# EAGLE design BATT_CPU_TEST (EAGLE 9.5.2)
COMPANY: ADAFRUIT INDUSTRIES; DRAWN: KTOWN; REV: B
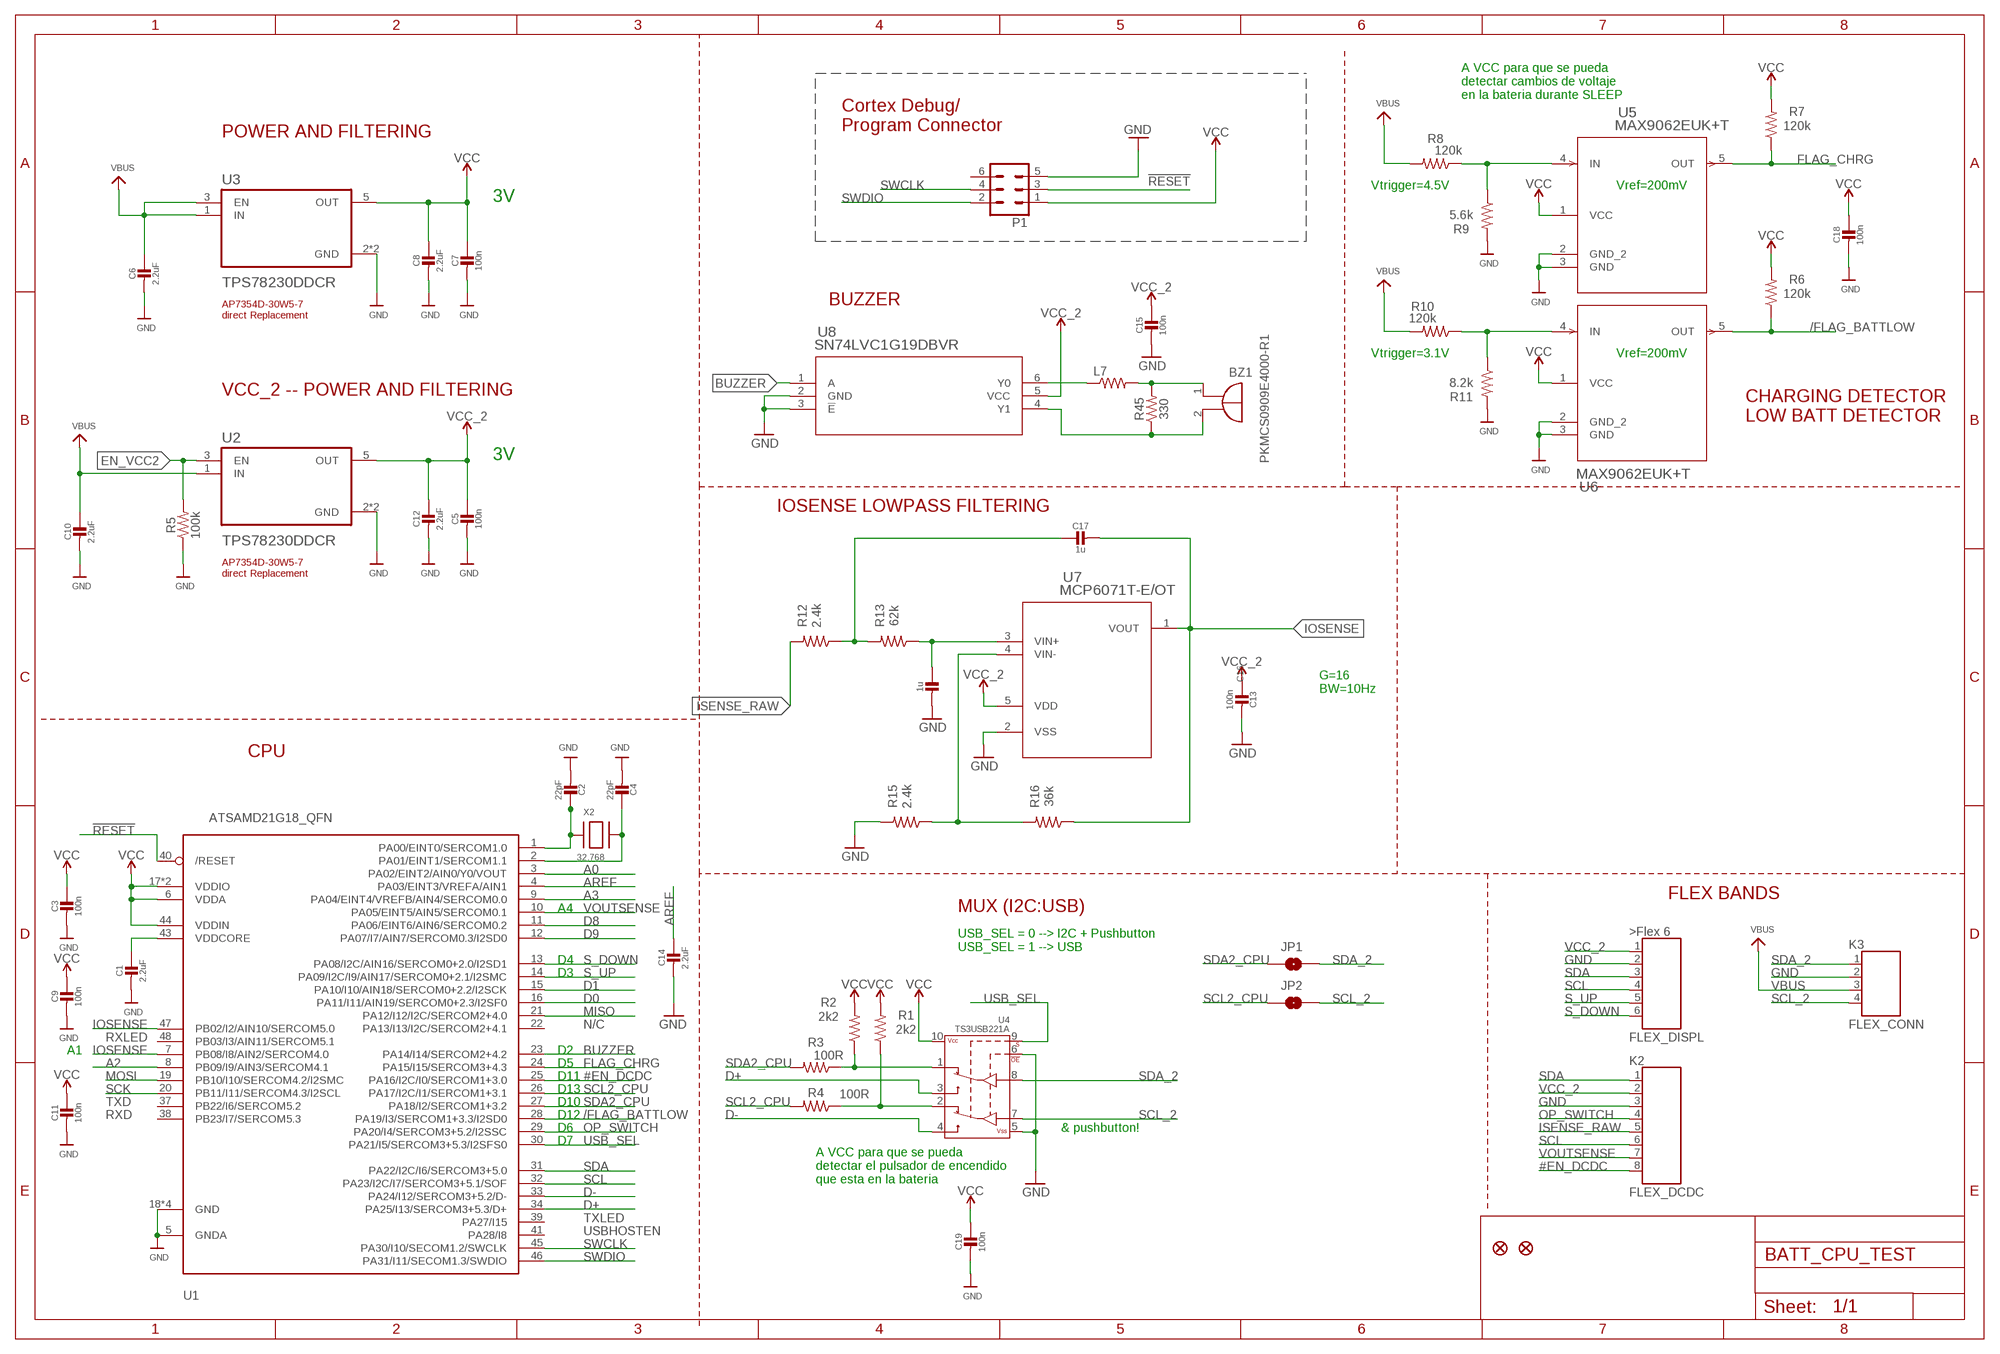
[diagram p0: schematic, sheet 1]

## Parts
BZ1  PKMCS0909E4000-R1  [PKMCS0909]
C1  2.2uF  CAP_CERAMIC0603_NO  [0603-NO]
C2  22pF  CAP_CERAMIC0603_NO  [0603-NO]
C3  100n  CAP_CERAMIC0603_NO  [0603-NO]
C4  22pF  CAP_CERAMIC0603_NO  [0603-NO]
C5  100n  CAP_CERAMIC0603_NO  [0603-NO]
C6  2.2uF  CAP_CERAMIC0805-NOOUTLINE  [0805-NO]
C7  100n  CAP_CERAMIC0603_NO  [0603-NO]
C8  2.2uF  CAP_CERAMIC0805-NOOUTLINE  [0805-NO]
C9  100n  CAP_CERAMIC0603_NO  [0603-NO]
C10  2.2uF  CAP_CERAMIC0805-NOOUTLINE  [0805-NO]
C11  100n  CAP_CERAMIC0603_NO  [0603-NO]
C12  2.2uF  CAP_CERAMIC0805-NOOUTLINE  [0805-NO]
C13  100n  CAP_CERAMIC0603_NO  [0603-NO]
C14  2.2uF  CAP_CERAMIC0603_NO  [0603-NO]
C15  100n  CAP_CERAMIC0603_NO  [0603-NO]
C16  1u  CAP_CERAMIC0603_NO  [0603-NO]
C17  1u  CAP_CERAMIC0603_NO  [0603-NO]
C18  100n  CAP_CERAMIC0603_NO  [0603-NO]
C19  100n  CAP_CERAMIC0603_NO  [0603-NO]
JP1  JUMPER-SMT_2_NO_SILK  [SMT-JUMPER_2_NO_SILK]
JP2  JUMPER-SMT_2_NO_SILK  [SMT-JUMPER_2_NO_SILK]
K1  FLEX_DISPL  FLEX6  [FLEX6]
K2  FLEX_DCDC  FLEX8  [FLEX8]
K3  FLEX_CONN  FLEX4  [FLEX4]
L7  MMZ2012Y202BT000  RESISTOR0805-RES  [0805]
P1  CONN03X2-PROGRAM-POGO-SWD-1.27  [2X3-PROGRAM-POGO-SWD-1.27]
R1  2k2  RESISTOR0603  [0603]
R2  2k2  RESISTOR0603  [0603]
R3  100R  RESISTOR0603  [0603]
R4  100R  RESISTOR0603  [0603]
R5  100k  RESISTOR0603  [0603]
R6  120k  RESISTOR0603  [0603]
R7  120k  RESISTOR0603  [0603]
R8  120k  RESISTOR0603  [0603]
R9  5.6k  RESISTOR0603  [0603]
R10  120k  RESISTOR0603  [0603]
R11  8.2k  RESISTOR0603  [0603]
R12  2.4k  RESISTOR0603  [0603]
R13  62k  RESISTOR0603  [0603]
R15  2.4k  RESISTOR0603  [0603]
R16  36k  RESISTOR0603  [0603]
R45  330  RESISTOR0603  [0603]
U1  ATSAMD21G18_QFN  ATSAMD21J_QFN  [TQFN48_7MM]
U2  TPS78230DDCR  [SOT95P280X110-5N]
U3  TPS78230DDCR  [SOT95P280X110-5N]
U4  TS3USB221A  [QFN-10-RSE]
U5  MAX9062EUK+T  [21-0057F_MXM]
U6  MAX9062EUK+T  [21-0057F_MXM]
U7  MCP6071T-E/OT  [SOT-23-5_MC_MCH]
U8  SN74LVC1G19DBVR  [DBV6]
U$34  FIDUCIAL""  [FIDUCIAL_1MM]
U$35  FIDUCIAL""  [FIDUCIAL_1MM]
X2  32.768  XTAL-3.2X1.5  [XTAL3215]

## Nets
!RESET: P1.3 U1.40(/RESET)
#EN_DCDC: K2.8 U1.25(PA16/I2C/I0/SERCOM1+3.0)
/FLAG_BATTLOW: R6.1 U1.28(PA19/I3/SERCOM1+3.3/I2SD0) U6.5(OUT)
A0: U1.3(PA02/EINT2/AIN0/Y0/VOUT)
A2: U1.8(PB09/I9/AIN3/SERCOM4.1)
A3: U1.9(PA04/EINT4/VREFB/AIN4/SERCOM0.0)
AREF: C14.1 U1.4(PA03/EINT3/VREFA/AIN1)
BUZZER: U1.23(PA14/I14/SERCOM2+4.2) U8.1(A)
D0: U1.16(PA11/I11/AIN19/SERCOM0+2.3/I2SF0)
D1: U1.15(PA10/I10/AIN18/SERCOM0+2.2/I2SCK)
D8: U1.11(PA06/EINT6/AIN6/SERCOM0.2)
D9: U1.12(PA07/I7/AIN7/SERCOM0.3/I2SD0)
D+: U1.34(PA25/I13/SERCOM3+5.3/D+) U4.3(2D+)
D-: U1.33(PA24/I12/SERCOM3+5.2/D-) U4.4(2D-)
EN_VCC2: R5.2 U2.3(EN)
FLAG_CHRG: R7.1 U1.24(PA15/I15/SERCOM3+4.3) U5.5(OUT)
GND: C1.2 C2.2 C3.2 C4.2 C5.2 C6.2 C7.2 C8.2 C9.2 C10.2 C11.2 C12.2 C13.2 C14.2 C15.2 C16.2 C18.2 C19.2 K1.2 K2.3 K3.2 P1.5 R5.1 R9.2 R11.2 R15.2 U1.5(GNDA) U1.18(GND) U1.35(GND) U1.42(GND) U1.THERMAL(GND) U2.2(GND) U2.4(GND) U3.2(GND) U3.4(GND) U4.5(VSS) U4.6(!OE) U5.2(GND_2) U5.3(GND) U6.2(GND_2) U6.3(GND) U7.2(VSS) U8.2(GND) U8.3(!E)
IOSENSE: C17.2 R16.1 U1.7(PB08/I8/AIN2/SERCOM4.0) U1.47(PB02/I2/AIN10/SERCOM5.0) U7.1(VOUT)
ISENSE_RAW: K2.5 R12.2
MISO: U1.21(PA12/I12/I2C/SERCOM2+4.0)
MOSI: U1.19(PB10/I10/SERCOM4.2/I2SMC)
N$1: R15.1 R16.2 U7.4(VIN-)
N$2: R2.1 R3.1 U4.1(1D+)
N$3: R1.1 R4.1 U4.2(1D-)
N$5: C2.1 U1.1(PA00/EINT0/SERCOM1.0) X2.P$1
N$7: C4.1 U1.2(PA01/EINT1/SERCOM1.1) X2.P$2
N$8: C17.1 R12.1 R13.2
N$10: R10.1 R11.1 U6.4(IN)
N$11: R8.1 R9.1 U5.4(IN)
N$13: C16.1 R13.1 U7.3(VIN+)
N$17: L7.1 U8.6(Y0)
N$19: BZ1.1(+) L7.2 R45.2
N$22: BZ1.2(-) R45.1 U8.4(Y1)
OP_SWITCH: K2.4 U1.29(PA20/I4/SERCOM3+5.2/I2SSC)
S_DOWN: K1.6 U1.13(PA08/I2C/AIN16/SERCOM0+2.0/I2SD1)
S_UP: K1.5 U1.14(PA09/I2C/I9/AIN17/SERCOM0+2.1/I2SMC)
SCK: U1.20(PB11/I11/SERCOM4.3/I2SCL)
SCL: K1.4 K2.6 U1.32(PA23/I2C/I7/SERCOM3+5.1/SOF)
SCL2_CPU: JP2.1 R4.2 U1.26(PA17/I2C/I1/SERCOM1+3.1)
SCL_2: JP2.2 K3.4 U4.7(D-)
SDA: K1.3 K2.1 U1.31(PA22/I2C/I6/SERCOM3+5.0)
SDA2_CPU: JP1.1 R3.2 U1.27(PA18/I2/SERCOM1+3.2)
SDA_2: JP1.2 K3.1 U4.8(D+)
SWCLK: P1.4 U1.45(PA30/I10/SECOM1.2/SWCLK)
SWDIO: P1.2 U1.46(PA31/I11/SECOM1.3/SWDIO)
USB_SEL: U1.30(PA21/I5/SERCOM3+5.3/I2SFS0) U4.9(S)
VBUS: C6.1 C10.1 K3.3 R8.2 R10.2 U2.1(IN) U3.1(IN) U3.3(EN)
VCC: C3.1 C7.1 C8.1 C9.1 C11.1 C18.1 C19.1 P1.1 R1.2 R2.2 R6.2 R7.2 U1.6(VDDA) U1.17(VDDIO) U1.36(VDDIO) U1.44(VDDIN) U3.5(OUT) U4.10(VCC) U5.1(VCC) U6.1(VCC)
VCC_2: C5.1 C12.1 C13.1 C15.1 K1.1 K2.2 U2.5(OUT) U7.5(VDD) U8.5(VCC)
VDDCORE: C1.1 U1.43(VDDCORE)
VOUTSENSE: K2.7 U1.10(PA05/EINT5/AIN5/SERCOM0.1)
Unconnected: P1.6 U1.22(PA13/I13/I2C/SERCOM2+4.1) U1.37(PB22/I6/SERCOM5.2) U1.38(PB23/I7/SERCOM5.3) U1.39(PA27/I15) U1.41(PA28/I8) U1.48(PB03/I3/AIN11/SERCOM5.1)

## Notes on the sheet
- Cortex Debug/
  Program Connector
- A VCC para que se pueda
  detectar cambios de voltaje
  en la bateria durante SLEEP
- POWER AND FILTERING
- Vtrigger=4.5V | Vref=200mV
- 3V
- BUZZER
- AP7354D-30W5-7 
  direct Replacement
- Vtrigger=3.1V | Vref=200mV
- VCC_2 -- POWER AND FILTERING
- CHARGING DETECTOR
  LOW BATT DETECTOR
- 3V
- IOSENSE LOWPASS FILTERING
- AP7354D-30W5-7 
  direct Replacement
- G=16
  BW=10Hz
- CPU
- FLEX BANDS
- A4 | MUX (I2C:USB)
- USB_SEL = 0 --> I2C + Pushbutton
  USB_SEL = 1 --> USB
- D4
- D3
- N/C
- RXLED
- A1 | D2
- D5
- D11
- D13
- TXD | D10
- RXD | D12
- D6 | & pushbutton!
- D7
- A VCC para que se pueda
  detectar el pulsador de encendido
  que esta en la bateria
- TXLED
- USBHOSTEN

## Library data of the parts
BZ1 = buzzer:PKMCS0909E4000-R1: PKMCS0909E4000-R1 Source : http://www.murata.com/~/media/webrenewal/products/sound/sounder/vppt-buzj083-d.ashx
C1-C19 = microbuilder:CAP_CERAMIC: Ceramic Capacitors For new designs, use the packages preceded by an '_' character since they are more reliable: The following footprints should be used on most boards: _0402 - Standard footprint for regular board layouts _0603 - Standard footprint for regular board layouts _0805 - Standard footprint for regular board layouts _1206 - Standard footprint for regular board layouts For extremely tight-pitch boards where space is at a premium, the following 'micro-pitch' footprints can be used (smaller pads, no silkscreen outline, etc.): _0402MP - Micro-pitch footprint for very dense/compact boards _0603MP - Micro-pitch footprint for very dense/compact boards _0805MP - Micro-pitch footprint for very dense/compact boards _1206MP - Micro-pitch footprint for very dense/compact boards
JP1 JP2 = SparkFun-Jumpers:JUMPER-SMT_2_NO: Normally open jumper This jumper has two pads in close proximity to each other. Apply solder to close the connection. Round pads are easier to solder for beginners, but are a lot larger. SparkFun Product that uses the round pads: SparkFun EL Sequencer <https://www.sparkfun.com/products/12781>
K1 = Flex_Faja_connector:FLEX6: WR-FPC 1mm SMT Horiz. Bot. Contact Hinge type WR-FPC 1mm 06 pins Hinge type SMT Horizontal Bottom Contact ;=>Code : Con_FPC_ZIF_1.00_6861xx148922_686106148922 <http://katalog.we-online.de/media/images/eican/Con_FPC_ZIF_1.00_686110148922_pf2.jpg> Details see: http://katalog.we-online.de/em/datasheet/6861xx148922.pdf Created 2014-10-08, Karrer Zheng 2014 (C) Wurth Elektronik
K2 = Flex_Faja_connector:FLEX8: WR-FPC 1mm SMT Horiz. Bot. Contact Hinge type WR-FPC 1mm 08 pins Hinge type SMT Horizontal Bottom Contact ;=>Code : Con_FPC_ZIF_1.00_6861xx148922_686108148922 <http://katalog.we-online.de/media/images/eican/Con_FPC_ZIF_1.00_686110148922_pf2.jpg> Details see: http://katalog.we-online.de/em/datasheet/6861xx148922.pdf Created 2014-10-08, Karrer Zheng 2014 (C) Wurth Elektronik
K3 = Flex4:FLEX4
L7 = SparkFun:RESISTOR: Resistor Basic schematic elements and footprints for 0603, 1206, and PTH resistors.
P1 = Pogopin_2x3_127:CONN03X2-PROGRAM-POGO-SWD-1.27
R1-R13 R15 R16 R45 = SparkFun-Resistors:RESISTOR: Generic Resistor Package
U1 = microbuilder:ATSAMD21J
U2 U3 = TPS78230DDCR:TPS78230DDCR: Check prices <https://pricing.snapeda.com/parts/TPS78230DDCR/Texas%20Instruments/view-part?ref=eda>; AVAILABILITY: Good; DESCRIPTION: 150-mA, nano-IQ, low-dropout voltage regulator with enable from -40C to +125C 5-SOT-23-THIN -40 to 125; MF: Texas Instruments; MP: TPS78230DDCR; PACKAGE: SOT-23-THN-5 Texas Instruments; PRICE: None; PURCHASE-URL: https://pricing.snapeda.com/search/part/TPS78230DDCR/?ref=eda
U4 = SparkFun-IC-Special-Function:TS3USB221A: DPDT Analog Mux DPDT Analog Mux Vcc 2.5 to 3.3V Passes up to 5.5V at 3.3V supply 900MHz BW, 6Ω switch resistance SparkFun Products SparkFun FTDI SmartBasic <https://www.sparkfun.com/products/12935> (DEV-12935); PROD_ID: IC-12115
U5 U6 = MAX9062:MAX9062EUK+T; BUILT_BY: EMA_UL_Team; MANUFACTURER_PART_NUMBER: MAX9062EUK+T; SOURCELIBRARY: Maxim_2014-06-20; VENDOR: Maxim Integrated Products
U7 = MCP6071:MCP6071T-E/OT; BUILT_BY: EMA_Jessica; COPYRIGHT: Copyright (C) 2018 Accelerated Designs. All rights reserved; MANUFACTURER_PART_NUMBER: MCP6071T-E/OT; SOURCELIBRARY: Microchip_2019-08-23_21; VENDOR: Microchip
U8 = SN74LVC1G19DBVR:SN74LVC1G19DBVR; DATASHEET_URL: http://www.ti.com/lit/gpn/SN74LVC1G19; DESCRIPTION: 1-of-2 Decoder/Demultiplexer; FAMILY_NAME: LL Decoder, Mux/Demux; GENERIC_PART_NUMBER: SN74LVC1G19; INDUSTRY_STD_PKG_TYPE: SOT-23; MANUFACTURER: Texas Instruments; MANUFACTURER_PART_NUMBER: SN74LVC1G19DBVR; PACKAGE_DESIGNATOR: DBV; PIN_COUNT: 6; VENDOR: Texas Instruments
U$34 U$35 = microbuilder:FIDUCIAL: Fiducial Alignment Points Various fiducial points for machine vision alignment.; BOM: EXCLUDE
X2 = adafruit2:XTAL: Low cost SMT crystals, no capacitors included http://www.ladyada.net/library/eagle

## Net classes
2 gnd: width 0.305 mm, drill 0.483 mm, clearance 0.203 mm

## Board
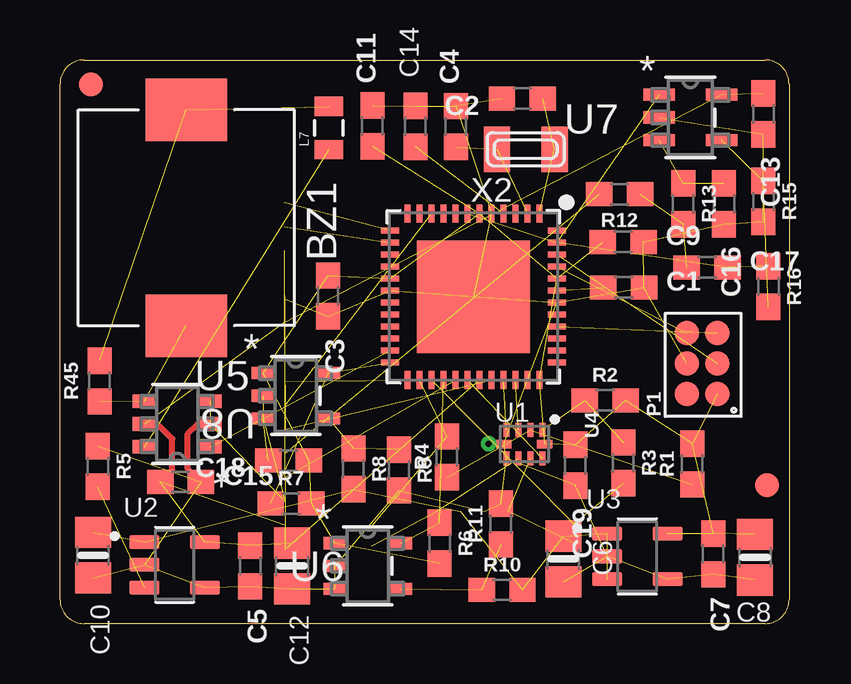
[diagram p1: board, top side]
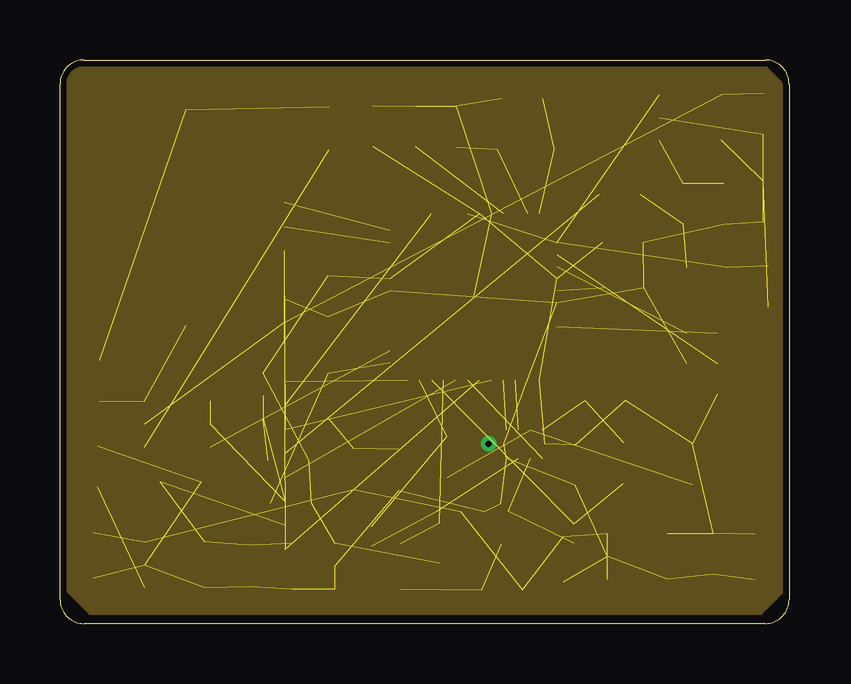
[diagram p2: board, inner layer Route2]
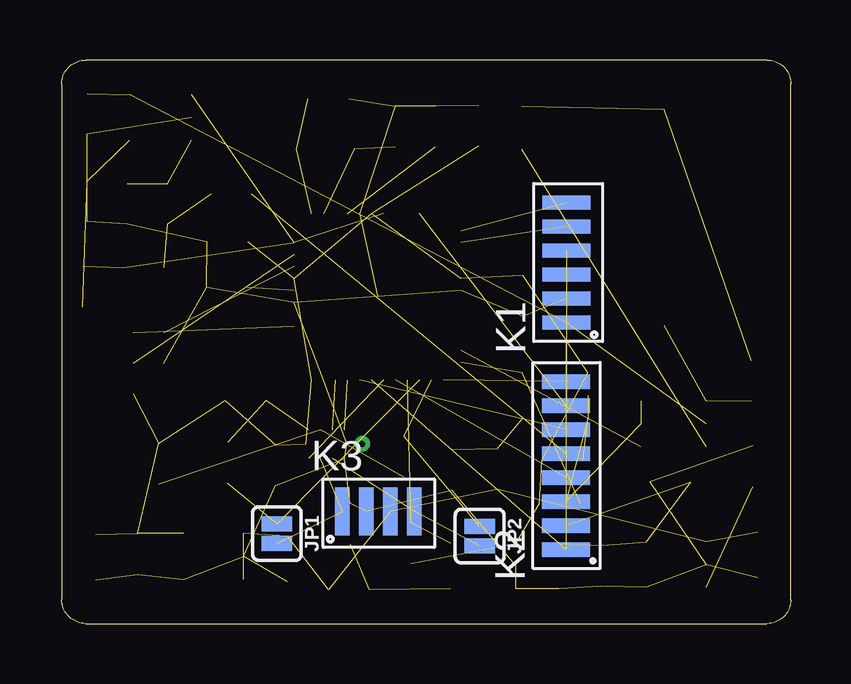
[diagram p3: board, bottom side, seen from below]

Size 30.4 x 23.5 mm. Coordinates in mm from the lower left corner, seen from the top.
Outline: 1,23.5 29.4,23.5 arc-90 30.4,22.5 30.4,1 arc-90 29.4,0 1,0 arc-90 0,1 0,22.5 arc-90 1,23.5
Copper layers (1+2*15+16): Top 0.035mm / dielectric 1.5mm / Route2 0.035mm / dielectric 0.15mm / Route15 0.035mm / dielectric 0.2mm / Bottom 0.035mm
Design rules "adafruit *": minimum track width 8mil, minimum drill 15.5mil, track to track 8mil, track to pad 8mil, pad to pad 8mil, via to via 8mil, smd to smd 8mil, copper to edge 10mil, drill to drill 8mil, minimum pad ring 10mil, minimum via ring 8mil, stop-mask expansion 2mil, vias tented up to drill 20mil, thermal gap 10mil
tRestrict: area -2.4,8.3 to -2.1,11.1; area -1.7,13.5 to 3.3,13.8; area 2.8,11.1 to 3.3,13.6

### Footprints (pad centres in the part's own frame; a part is rotated, then mirrored left to right if it is on the bottom)
PKMCS0909 = smd 2.6 x 3.4: 1 -4.5,0; 2 4.5,0
0603-NO = smd 1.1 x 1: 1 -0.85,0; 2 0.85,0
0805-NO = smd 1.3 x 1.5: 1 -0.95,0; 2 0.95,0
SMT-JUMPER_2_NO_SILK = smd 0.635 x 1.27: 1 -0.406,0; 2 0.406,0
FLEX6 = smd 0.6 x 2: 1 -2.5,0.25; 2 -1.5,0.25; 3 -0.5,0.25; 4 0.5,0.25; 5 1.5,0.25; 6 2.5,0.25
FLEX8 = smd 0.6 x 2: 1 -3.5,0.25; 2 -2.5,0.25; 3 -1.5,0.25; 4 -0.5,0.25; 5 0.5,0.25; 6 1.5,0.25; 7 2.5,0.25; 8 3.5,0.25
FLEX4 = smd 0.6 x 2: 1 -3.77,1.52; 2 -2.77,1.52; 3 -1.77,1.52; 4 -0.77,1.52
0805 = smd 0.8 x 1.2: 1 -0.9,0; 2 0.9,0
2X3-PROGRAM-POGO-SWD-1.27 = smd 1.016 x 1.016: 1 -1.27,-0.635; 2 0,-0.635; 3 1.27,-0.635; 4 1.27,0.635; 5 0,0.635; 6 -1.27,0.635
0603 = smd 1.1 x 1: 1 -0.85,0; 2 0.85,0
TQFN48_7MM = smd 0.25 x 0.75: 1 -2.75,-3.475; 2 -2.25,-3.475; 3 -1.75,-3.475; 4 -1.25,-3.475; 5 -0.75,-3.475; 6 -0.25,-3.475; 7 0.25,-3.475; 8 0.75,-3.475; 9 1.25,-3.475; 10 1.75,-3.475; 11 2.25,-3.475; 12 2.75,-3.475; 25 2.75,3.475; 26 2.25,3.475; 27 1.75,3.475; 28 1.25,3.475; 29 0.75,3.475; 30 0.25,3.475; 31 -0.25,3.475; 32 -0.75,3.475; 33 -1.25,3.475; 34 -1.75,3.475; 35 -2.25,3.475; 36 -2.75,3.475 | smd 0.75 x 0.25: 13 3.475,-2.75; 14 3.475,-2.25; 15 3.475,-1.75; 16 3.475,-1.25; 17 3.475,-0.75; 18 3.475,-0.25; 19 3.475,0.25; 20 3.475,0.75; 21 3.475,1.25; 22 3.475,1.75; 23 3.475,2.25; 24 3.475,2.75; 37 -3.475,2.75; 38 -3.475,2.25; 39 -3.475,1.75; 40 -3.475,1.25; 41 -3.475,0.75; 42 -3.475,0.25; 43 -3.475,-0.25; 44 -3.475,-0.75; 45 -3.475,-1.25; 46 -3.475,-1.75; 47 -3.475,-2.25; 48 -3.475,-2.75 | smd 4.7 x 4.7: THERMAL 0,0
SOT95P280X110-5N = smd 1.25 x 0.59: 1 -1.255,0.95; 2 -1.255,0; 3 -1.255,-0.95; 4 1.255,-0.95; 5 1.255,0.95
QFN-10-RSE = smd 0.58 x 0.25: 1 -0.6,0.75; 2 -0.6,0.25; 3 -0.6,-0.25; 4 -0.6,-0.75; 6 0.6,-0.75; 7 0.6,-0.25; 8 0.6,0.25; 9 0.6,0.75 | smd 0.35 x 0.63: 5 0,-0.85; 10 0,0.85
21-0057F_MXM = smd 0.972 x 0.508: 1 -1.362,0.95; 2 -1.362,0; 3 -1.362,-0.95; 4 1.362,-0.95; 5 1.362,0.95
SOT-23-5_MC_MCH = smd 1.31 x 0.508: 1 -1.295,0.95; 2 -1.295,0; 3 -1.295,-0.95; 4 1.295,-0.95; 5 1.295,0.95
DBV6 = smd 0.972 x 0.568: 1 -1.362,0.95; 2 -1.362,0; 3 -1.362,-0.95; 4 1.362,-0.95; 5 1.362,0; 6 1.362,0.95
FIDUCIAL_1MM = smd 1 x 1: 1 0,0
XTAL3215 = smd 1.1 x 1.9: P$1 1.2,0; P$2 -1.2,0

### Placement (x,y rotation side)
BZ1  5.27,16.92 270 top
C1  23.5,14.01 0 top
C2  19.28,21.89 180 top
C3  11.17,13.66 270 top
C4  16.5,20.72 90 top
C5  7.93,2.4 270 top
C6  20.98,2.69 270 top
C7  27.23,2.9 270 top
C8  28.98,2.76 270 top
C9  23.48,15.91 0 top
C10  1.38,2.85 270 top
C11  13.03,20.75 90 top
C12  9.68,2.4 270 top
C13  29.33,21.25 270 top
C14  14.82,20.73 90 top
C15  5.03,5.9 0 top
C16  27.68,17.5 270 top
C17  26.98,14.85 0 top
C18  9.53,6.8 180 top
C19  21.48,6.6 270 top
JP1  21.43,3.75 270 bottom
JP2  12.98,3.65 270 bottom
K1  9.1,15.05 90 bottom
K2  9.13,6.59 90 bottom
K3  14.93,3.15 0 bottom
L7  11.21,20.66 90 top
P1  26.78,10.85 90 top
R1  26.36,6.65 90 top
R2  22.73,9.31 0 top
R3  23.48,6.7 270 top
R4  16.14,6.95 90 top
R5  1.58,6.55 270 top
R6  15.83,3.35 270 top
R7  9.63,5 0 top
R8  12.23,6.45 270 top
R9  14.13,6.4 270 top
R10  18.43,1.4 0 top
R11  18.38,4.15 90 top
R12  23.33,17.9 180 top
R13  25.98,17.5 270 top
R15  29.33,17.6 270 top
R16  29.53,14.05 270 top
R45  1.65,10.11 90 top
U1  17.24,13.63 180 top
U2  4.78,2.45 0 top
U3  24.07,2.8 0 top
U4  19.36,7.48 270 top
U5  9.83,9.5 0 top
U6  12.83,2.4 0 top
U7  26.28,21.1 0 top
U8  4.89,8.32 180 top
U$34  29.47,5.76 90 top
U$35  1.3,22.47 0 top
X2  19.42,19.78 0 top

### Tracks (layer width: path | path; a pad name or v marks a point on that pad's centre or on a via)
!RESET  (1 unrouted)
#EN_DCDC  (1 unrouted)
/FLAG_BATTLOW  (2 unrouted)
AREF  (1 unrouted)
BUZZER  (1 unrouted)
D+  (1 unrouted)
D-  (1 unrouted)
EN_VCC2  (1 unrouted)
FLAG_CHRG  (2 unrouted)
GND  (via drill 0.25)  (42 unrouted)
  Top 0.203: U4.5 17.89,7.48 v17.87,7.5
  Top 0.254: C15.2 5.33,6.45 5.33,7.92 5.73,8.32 U8.2 | U4.5 17.9,7.48 v17.88,7.5
  pour Route2 (isolate 0.254): 0.23,22.9 0.23,1.4 1.23,0.4 29.23,0.4 30.23,1.4 30.23,22.4 29.23,23.4 0.73,23.4
IOSENSE  (4 unrouted)
ISENSE_RAW  (1 unrouted)
N$1  (2 unrouted)
N$2  (2 unrouted)
N$3  (2 unrouted)
N$5  (2 unrouted)
N$7  (2 unrouted)
N$8  (2 unrouted)
N$10  (2 unrouted)
N$11  (2 unrouted)
N$13  (2 unrouted)
N$17  (1 unrouted)
N$19  (2 unrouted)
N$22  (2 unrouted)
OP_SWITCH  (1 unrouted)
S_DOWN  (1 unrouted)
S_UP  (1 unrouted)
SCL  (2 unrouted)
SCL2_CPU  (2 unrouted)
SCL_2  (2 unrouted)
SDA  (2 unrouted)
SDA2_CPU  (2 unrouted)
SDA_2  (2 unrouted)
SWCLK  (1 unrouted)
SWDIO  (1 unrouted)
USB_SEL  (1 unrouted)
VBUS  (7 unrouted)
VCC  (19 unrouted)
VCC_2  (7 unrouted)
  Top 0.203: U8.5 4.06,8.32
  Top 0.254: C15.1 4.68,6.4 4.68,7.7 4.06,8.32
VDDCORE  (1 unrouted)
VOUTSENSE  (1 unrouted)